# EAGLE schematic DHT11 (EAGLE 7.6.0)
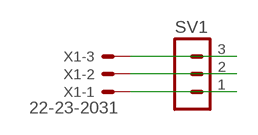
[diagram p0: schematic, sheet 1]

## Parts
SV1  MA03-1  [MA03-1]
X1  22-23-2031  [22-23-2031]

## Nets
GND: SV1.3 X1.3
N$1: SV1.1 X1.1
N$2: SV1.2 X1.2

## Library data of the parts
SV1 = con-lstb:MA03-1: PIN HEADER; OC_FARNELL: unknown; OC_NEWARK: unknown
X1 = con-molex:22-23-2031: .100" (2.54mm) Center Header - 3 Pin; MF: MOLEX; MPN: 22-23-2031; OC_FARNELL: 1462950; OC_NEWARK: 30C0862